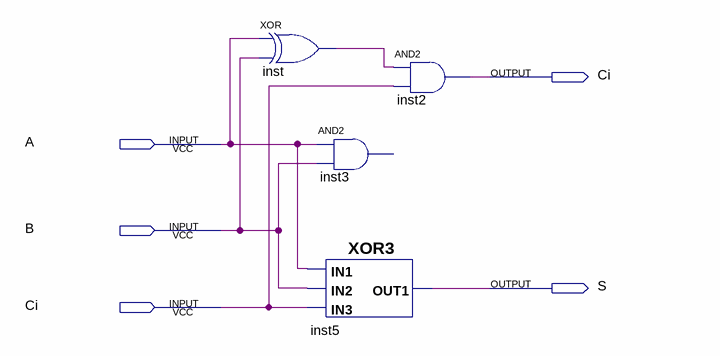
[diagram p0: schematic sheet]
// Quartus schematic fulladder.bdf as structural Verilog: 4 symbols, 5 pins
module fulladder (
  input  A,
  input  B,
  inout  Ci,
  output S
);

  wire inst_out;

  xor inst (inst_out, A, B);
  // AND2 inst3 has open pins: IN1=A, IN2=B, OUT=open
  XOR3 inst5 (.IN3(Ci), .IN1(A), .IN2(B), .OUT1(S));
  and inst2 (Ci, inst_out, Ci);
endmodule
